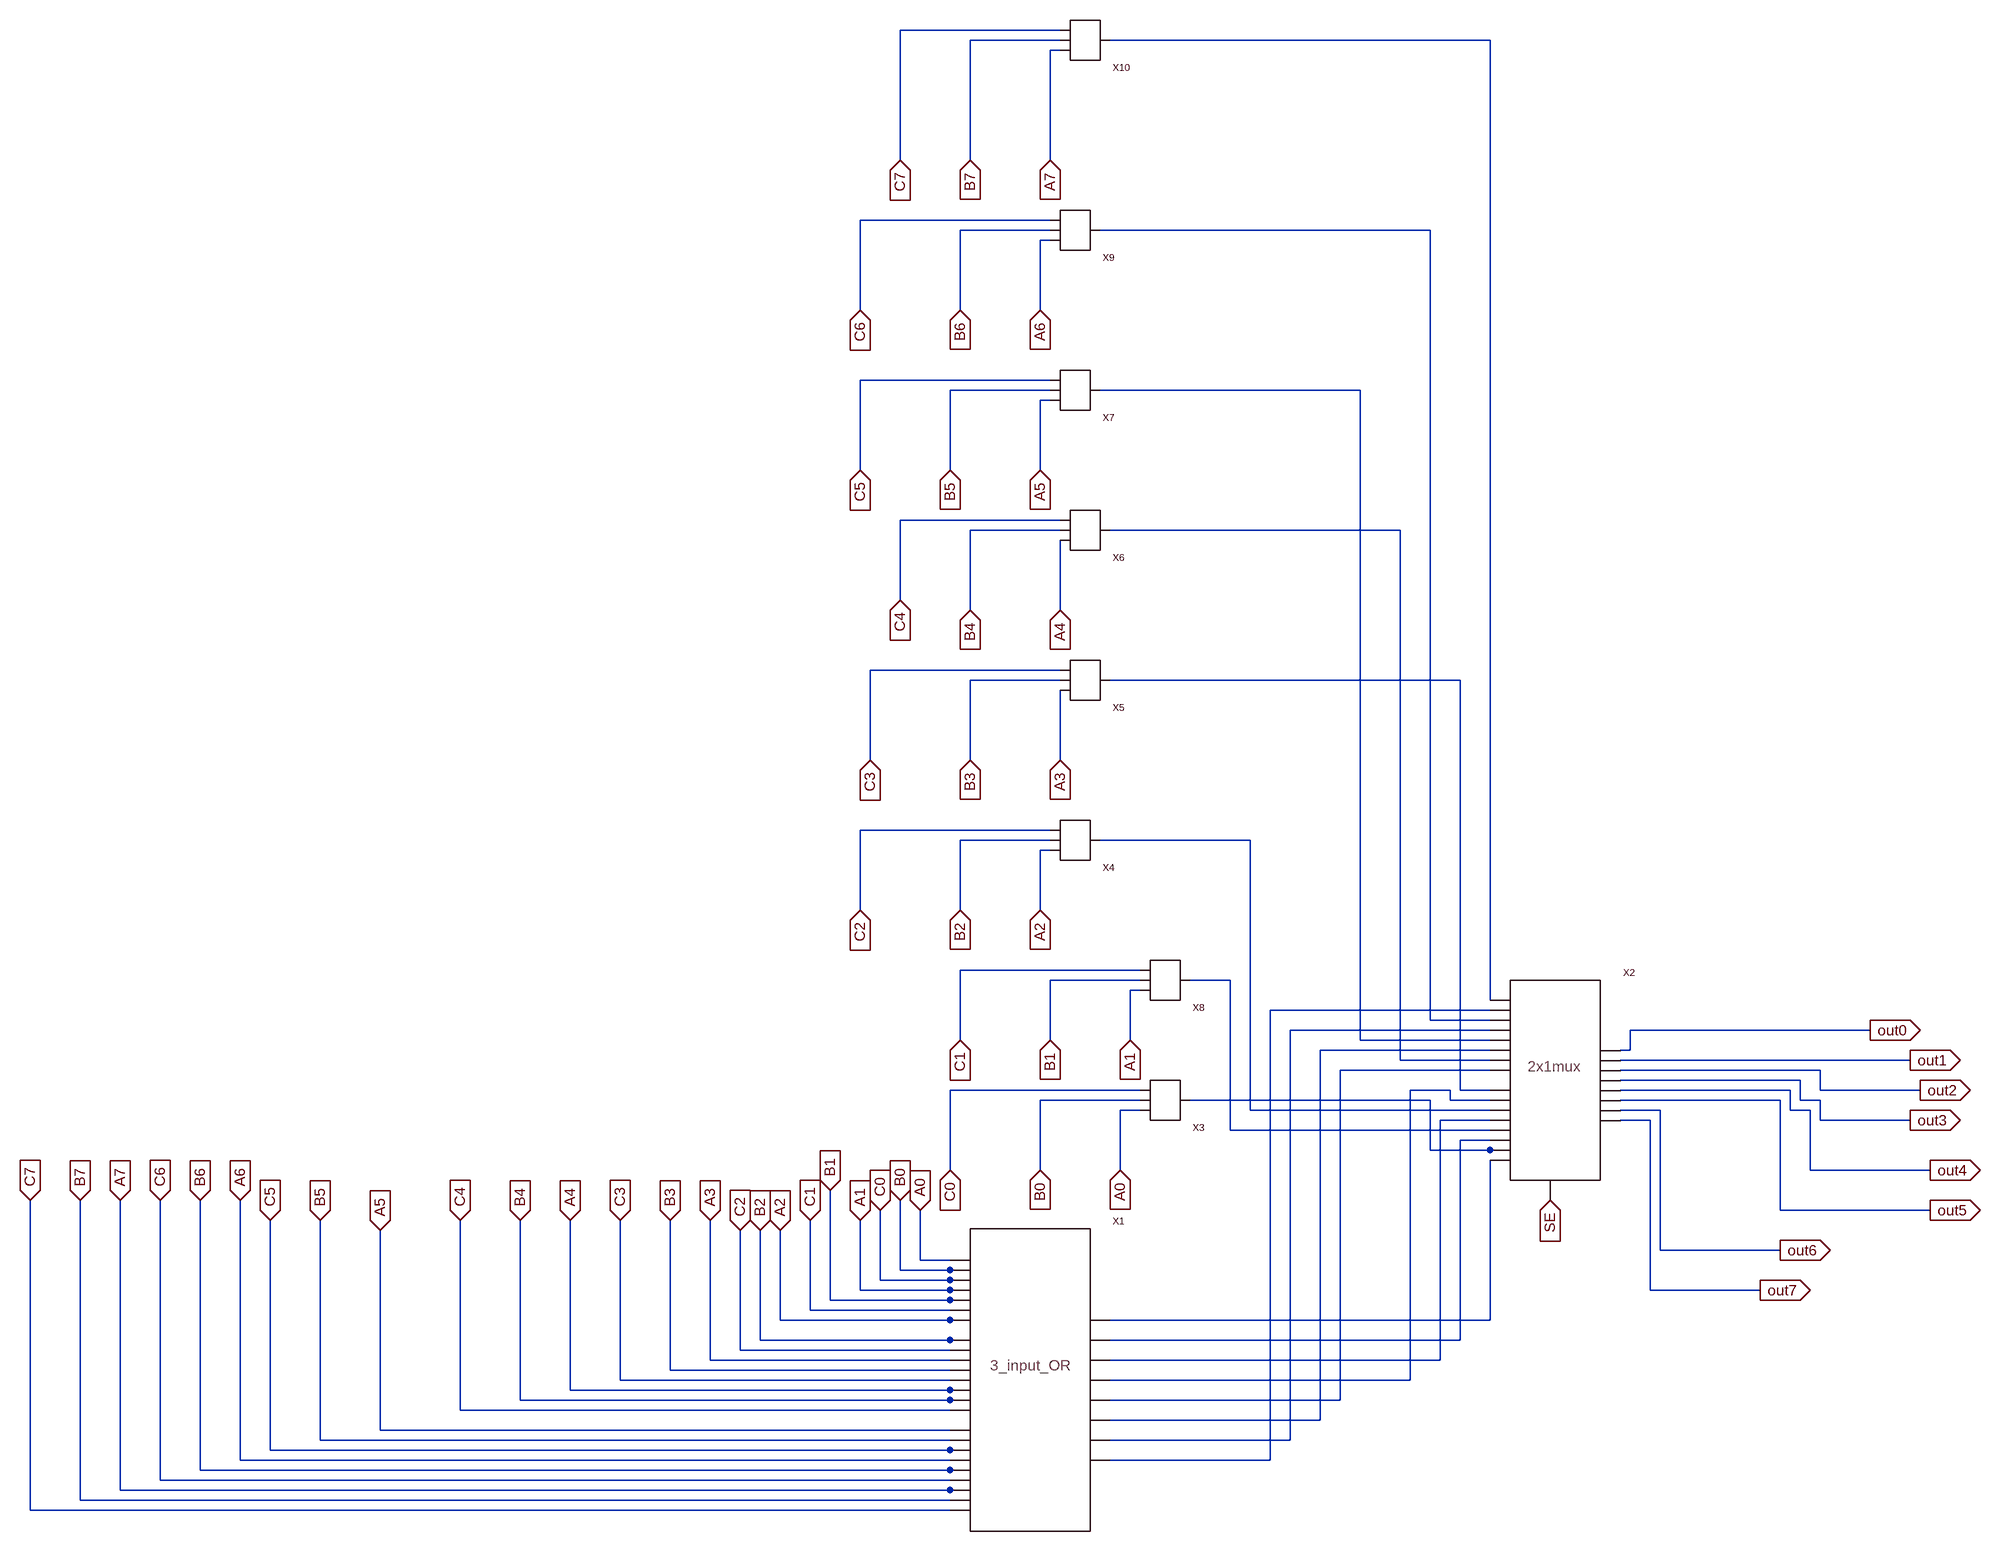
[diagram p0: schematic ALU.asc]
ALU.asc, the LTspice schematic file:
Version 4
SHEET 1 1052 2052
WIRE -544 -592 -800 -592
WIRE -544 -576 -688 -576
WIRE 144 -576 -464 -576
WIRE -544 -560 -560 -560
WIRE -800 -384 -800 -592
WIRE -688 -384 -688 -576
WIRE -560 -384 -560 -560
WIRE -560 -288 -864 -288
WIRE -560 -272 -704 -272
WIRE 48 -272 -480 -272
WIRE -560 -256 -576 -256
WIRE -864 -144 -864 -288
WIRE -704 -144 -704 -272
WIRE -576 -144 -576 -256
WIRE -560 -32 -864 -32
WIRE -560 -16 -720 -16
WIRE -64 -16 -480 -16
WIRE -560 0 -576 0
WIRE -864 112 -864 -32
WIRE -720 112 -720 -16
WIRE -576 112 -576 0
WIRE -544 192 -800 192
WIRE -544 208 -688 208
WIRE 0 208 -464 208
WIRE -800 320 -800 192
WIRE -688 336 -688 208
WIRE -544 336 -544 224
WIRE -544 432 -848 432
WIRE -544 448 -688 448
WIRE 96 448 -464 448
WIRE -848 576 -848 432
WIRE -688 576 -688 448
WIRE -544 576 -544 464
WIRE -560 688 -864 688
WIRE -560 704 -704 704
WIRE -240 704 -480 704
WIRE -560 720 -576 720
WIRE -864 816 -864 688
WIRE -704 816 -704 704
WIRE -576 816 -576 720
WIRE -416 912 -704 912
WIRE -416 928 -560 928
WIRE -272 928 -336 928
WIRE -416 944 -432 944
WIRE 144 960 144 -576
WIRE 144 976 -208 976
WIRE 48 992 48 -272
WIRE 144 992 48 992
WIRE 144 1008 -176 1008
WIRE 752 1008 368 1008
WIRE -704 1024 -704 912
WIRE -560 1024 -560 928
WIRE -432 1024 -432 944
WIRE -64 1024 -64 -16
WIRE 144 1024 -64 1024
WIRE 144 1040 -128 1040
WIRE 368 1040 368 1008
WIRE 368 1040 352 1040
WIRE 0 1056 0 208
WIRE 144 1056 0 1056
WIRE 816 1056 352 1056
WIRE 144 1072 -96 1072
WIRE 672 1072 352 1072
WIRE 640 1088 352 1088
WIRE -416 1104 -720 1104
WIRE 80 1104 16 1104
WIRE 96 1104 96 448
WIRE 144 1104 96 1104
WIRE 624 1104 352 1104
WIRE 672 1104 672 1072
WIRE 832 1104 672 1104
WIRE -416 1120 -576 1120
WIRE 48 1120 -336 1120
WIRE 80 1120 80 1104
WIRE 144 1120 80 1120
WIRE 608 1120 352 1120
WIRE 640 1120 640 1088
WIRE 672 1120 640 1120
WIRE -416 1136 -448 1136
WIRE -240 1136 -240 704
WIRE 144 1136 -240 1136
WIRE 416 1136 352 1136
WIRE 624 1136 624 1104
WIRE 656 1136 624 1136
WIRE 144 1152 64 1152
WIRE 400 1152 352 1152
WIRE 672 1152 672 1120
WIRE 816 1152 672 1152
WIRE -272 1168 -272 928
WIRE 144 1168 -272 1168
WIRE 144 1184 96 1184
WIRE 48 1200 48 1120
WIRE 144 1200 48 1200
WIRE 160 1200 144 1200
WIRE -720 1232 -720 1104
WIRE -576 1232 -576 1120
WIRE -448 1232 -448 1136
WIRE 656 1232 656 1136
WIRE 848 1232 656 1232
WIRE 608 1296 608 1120
WIRE 848 1296 608 1296
WIRE 416 1360 416 1136
WIRE 608 1360 416 1360
WIRE -768 1376 -768 1296
WIRE -720 1376 -768 1376
WIRE -800 1392 -800 1280
WIRE -720 1392 -800 1392
WIRE -704 1392 -720 1392
WIRE -832 1408 -832 1296
WIRE -720 1408 -832 1408
WIRE -704 1408 -720 1408
WIRE -864 1424 -864 1312
WIRE -720 1424 -864 1424
WIRE -704 1424 -720 1424
WIRE 400 1424 400 1152
WIRE 576 1424 400 1424
WIRE -912 1440 -912 1264
WIRE -720 1440 -912 1440
WIRE -704 1440 -720 1440
WIRE -944 1456 -944 1312
WIRE -720 1456 -944 1456
WIRE -992 1472 -992 1328
WIRE -720 1472 -992 1472
WIRE -688 1472 -720 1472
WIRE 144 1472 144 1216
WIRE 144 1472 -464 1472
WIRE -1024 1504 -1024 1328
WIRE -720 1504 -1024 1504
WIRE -704 1504 -720 1504
WIRE 96 1504 96 1184
WIRE 96 1504 -464 1504
WIRE -1056 1520 -1056 1328
WIRE -720 1520 -1056 1520
WIRE -1104 1536 -1104 1312
WIRE -720 1536 -1104 1536
WIRE 64 1536 64 1152
WIRE 64 1536 -464 1536
WIRE -1168 1552 -1168 1312
WIRE -720 1552 -1168 1552
WIRE -1248 1568 -1248 1312
WIRE -720 1568 -1248 1568
WIRE 16 1568 16 1104
WIRE 16 1568 -464 1568
WIRE -1328 1584 -1328 1312
WIRE -720 1584 -1328 1584
WIRE -704 1584 -720 1584
WIRE -1408 1600 -1408 1312
WIRE -720 1600 -1408 1600
WIRE -704 1600 -720 1600
WIRE -96 1600 -96 1072
WIRE -96 1600 -464 1600
WIRE -1504 1616 -1504 1312
WIRE -720 1616 -1504 1616
WIRE -128 1632 -128 1040
WIRE -128 1632 -464 1632
WIRE -1632 1648 -1632 1328
WIRE -720 1648 -1632 1648
WIRE -1728 1664 -1728 1312
WIRE -720 1664 -1728 1664
WIRE -176 1664 -176 1008
WIRE -176 1664 -464 1664
WIRE -1808 1680 -1808 1312
WIRE -720 1680 -1808 1680
WIRE -704 1680 -720 1680
WIRE -1856 1696 -1856 1280
WIRE -720 1696 -1856 1696
WIRE -208 1696 -208 976
WIRE -208 1696 -464 1696
WIRE -1920 1712 -1920 1280
WIRE -720 1712 -1920 1712
WIRE -704 1712 -720 1712
WIRE -1984 1728 -1984 1280
WIRE -720 1728 -1984 1728
WIRE -2048 1744 -2048 1280
WIRE -720 1744 -2048 1744
WIRE -704 1744 -720 1744
WIRE -2112 1760 -2112 1280
WIRE -720 1760 -2112 1760
WIRE -2192 1776 -2192 1280
WIRE -720 1776 -2192 1776
FLAG -800 -384 C7
IOPIN -800 -384 In
FLAG -864 -144 C6
IOPIN -864 -144 In
FLAG -864 112 C5
IOPIN -864 112 In
FLAG -800 320 C4
IOPIN -800 320 In
FLAG -848 576 C3
IOPIN -848 576 In
FLAG -864 816 C2
IOPIN -864 816 In
FLAG -704 1024 C1
IOPIN -704 1024 In
FLAG -720 1232 C0
IOPIN -720 1232 In
FLAG -688 -384 B7
IOPIN -688 -384 In
FLAG -560 -384 A7
IOPIN -560 -384 In
FLAG -704 -144 B6
IOPIN -704 -144 In
FLAG -576 -144 A6
IOPIN -576 -144 In
FLAG -720 112 B5
IOPIN -720 112 In
FLAG -576 112 A5
IOPIN -576 112 In
FLAG -688 336 B4
IOPIN -688 336 In
FLAG -544 336 A4
IOPIN -544 336 In
FLAG -688 576 B3
IOPIN -688 576 In
FLAG -544 576 A3
IOPIN -544 576 In
FLAG -704 816 B2
IOPIN -704 816 In
FLAG -576 816 A2
IOPIN -576 816 In
FLAG -560 1024 B1
IOPIN -560 1024 In
FLAG -432 1024 A1
IOPIN -432 1024 In
FLAG -576 1232 B0
IOPIN -576 1232 In
FLAG -448 1232 A0
IOPIN -448 1232 In
FLAG -832 1296 C0
IOPIN -832 1296 In
FLAG -800 1280 B0
IOPIN -800 1280 In
FLAG -768 1296 A0
IOPIN -768 1296 In
FLAG -944 1312 C1
IOPIN -944 1312 In
FLAG -912 1264 B1
IOPIN -912 1264 In
FLAG -864 1312 A1
IOPIN -864 1312 In
FLAG -1056 1328 C2
IOPIN -1056 1328 In
FLAG -1024 1328 B2
IOPIN -1024 1328 In
FLAG -992 1328 A2
IOPIN -992 1328 In
FLAG -1248 1312 C3
IOPIN -1248 1312 In
FLAG -1168 1312 B3
IOPIN -1168 1312 In
FLAG -1104 1312 A3
IOPIN -1104 1312 In
FLAG -1504 1312 C4
IOPIN -1504 1312 In
FLAG -1408 1312 B4
IOPIN -1408 1312 In
FLAG -1328 1312 A4
IOPIN -1328 1312 In
FLAG -1808 1312 C5
IOPIN -1808 1312 In
FLAG -1728 1312 B5
IOPIN -1728 1312 In
FLAG -1632 1328 A5
IOPIN -1632 1328 In
FLAG -1984 1280 C6
IOPIN -1984 1280 In
FLAG -1920 1280 B6
IOPIN -1920 1280 In
FLAG -1856 1280 A6
IOPIN -1856 1280 In
FLAG -2192 1280 C7
IOPIN -2192 1280 In
FLAG -2112 1280 B7
IOPIN -2112 1280 In
FLAG -2048 1280 A7
IOPIN -2048 1280 In
FLAG 752 1008 out0
IOPIN 752 1008 Out
FLAG 816 1056 out1
IOPIN 816 1056 Out
FLAG 832 1104 out2
IOPIN 832 1104 Out
FLAG 816 1152 out3
IOPIN 816 1152 Out
FLAG 848 1232 out4
IOPIN 848 1232 Out
FLAG 848 1296 out5
IOPIN 848 1296 Out
FLAG 608 1360 out6
IOPIN 608 1360 Out
FLAG 576 1424 out7
IOPIN 576 1424 Out
FLAG 240 1280 SE
IOPIN 240 1280 In
SYMBOL MUX_8input 560 1104 R0
SYMATTR InstName X2
SYMBOL XOP_Part1 -304 1088 M180
SYMATTR InstName X3
SYMBOL XOP_Part1 -448 672 M180
SYMATTR InstName X4
SYMBOL XOP_Part1 -432 416 M180
SYMATTR InstName X5
SYMBOL XOP_Part1 -432 176 M180
SYMATTR InstName X6
SYMBOL XOP_Part1 -448 -48 M180
SYMATTR InstName X7
SYMBOL XOP_Part1 -304 896 M180
SYMATTR InstName X8
SYMBOL XOP_Part1 -448 -304 M180
SYMATTR InstName X9
SYMBOL XOP_Part1 -432 -608 M180
SYMATTR InstName X10
SYMBOL 8bit_OR -336 1472 R0
SYMATTR InstName X1

The netlist it stands for:
* ALU.asc
XX2 N001 N008 N002 N009 N003 N010 N004 N011 N005 N012 N006 N014 N007 N015 N013 N016 out0 out1 out2 out3 out4 out5 out6 out7 SE MUX_8input  ; pins in1 in2 in3 in4 in5 in6 in7 in8 in9 in10 in11 in12 in13 in14 in15 in16 y0 y1 y2 y3 y4 y5 y6 y7 s
XX3 A0 B0 C0 N013 XOP_Part1  ; pins A B C Y
XX4 A2 B2 C2 N006 XOP_Part1  ; pins A B C Y
XX5 A3 B3 C3 N005 XOP_Part1  ; pins A B C Y
XX6 A4 B4 C4 N004 XOP_Part1  ; pins A B C Y
XX7 A5 B5 C5 N003 XOP_Part1  ; pins A B C Y
XX8 A1 B1 C1 N007 XOP_Part1  ; pins A B C Y
XX9 A6 B6 C6 N002 XOP_Part1  ; pins A B C Y
XX10 A7 B7 C7 N001 XOP_Part1  ; pins A B C Y
XX1 A0 B0 C0 A1 B1 C1 A2 B2 C2 A3 B3 C3 A4 B4 C4 A5 B5 C5 A6 B6 C6 A7 B7 C7 N016 N015 N014 N012 N011 N010 N009 N008 8bit_OR  ; pins A0 B0 C0 A1 B1 C1 A2 B2 C2 A3 B3 C3 A4 B4 C4 A5 B5 C5 A6 B6 C6 A7 B7 C7 Y0 Y1 Y2 Y3 Y4 Y5 Y6 Y7
.backanno
.end